# EasyEDA Pro project 摩托单驱(改）.eprj

# Schematic Schematic1
Create Date: 2023-11-26; Page Name: P1; Project Name: 有刷单驱第一版(2)更改; Schematic Name: Schematic1; Update Date: 2023-11-29; Company: 嘉立创EDA; Page Size: A4; Version: V1.0
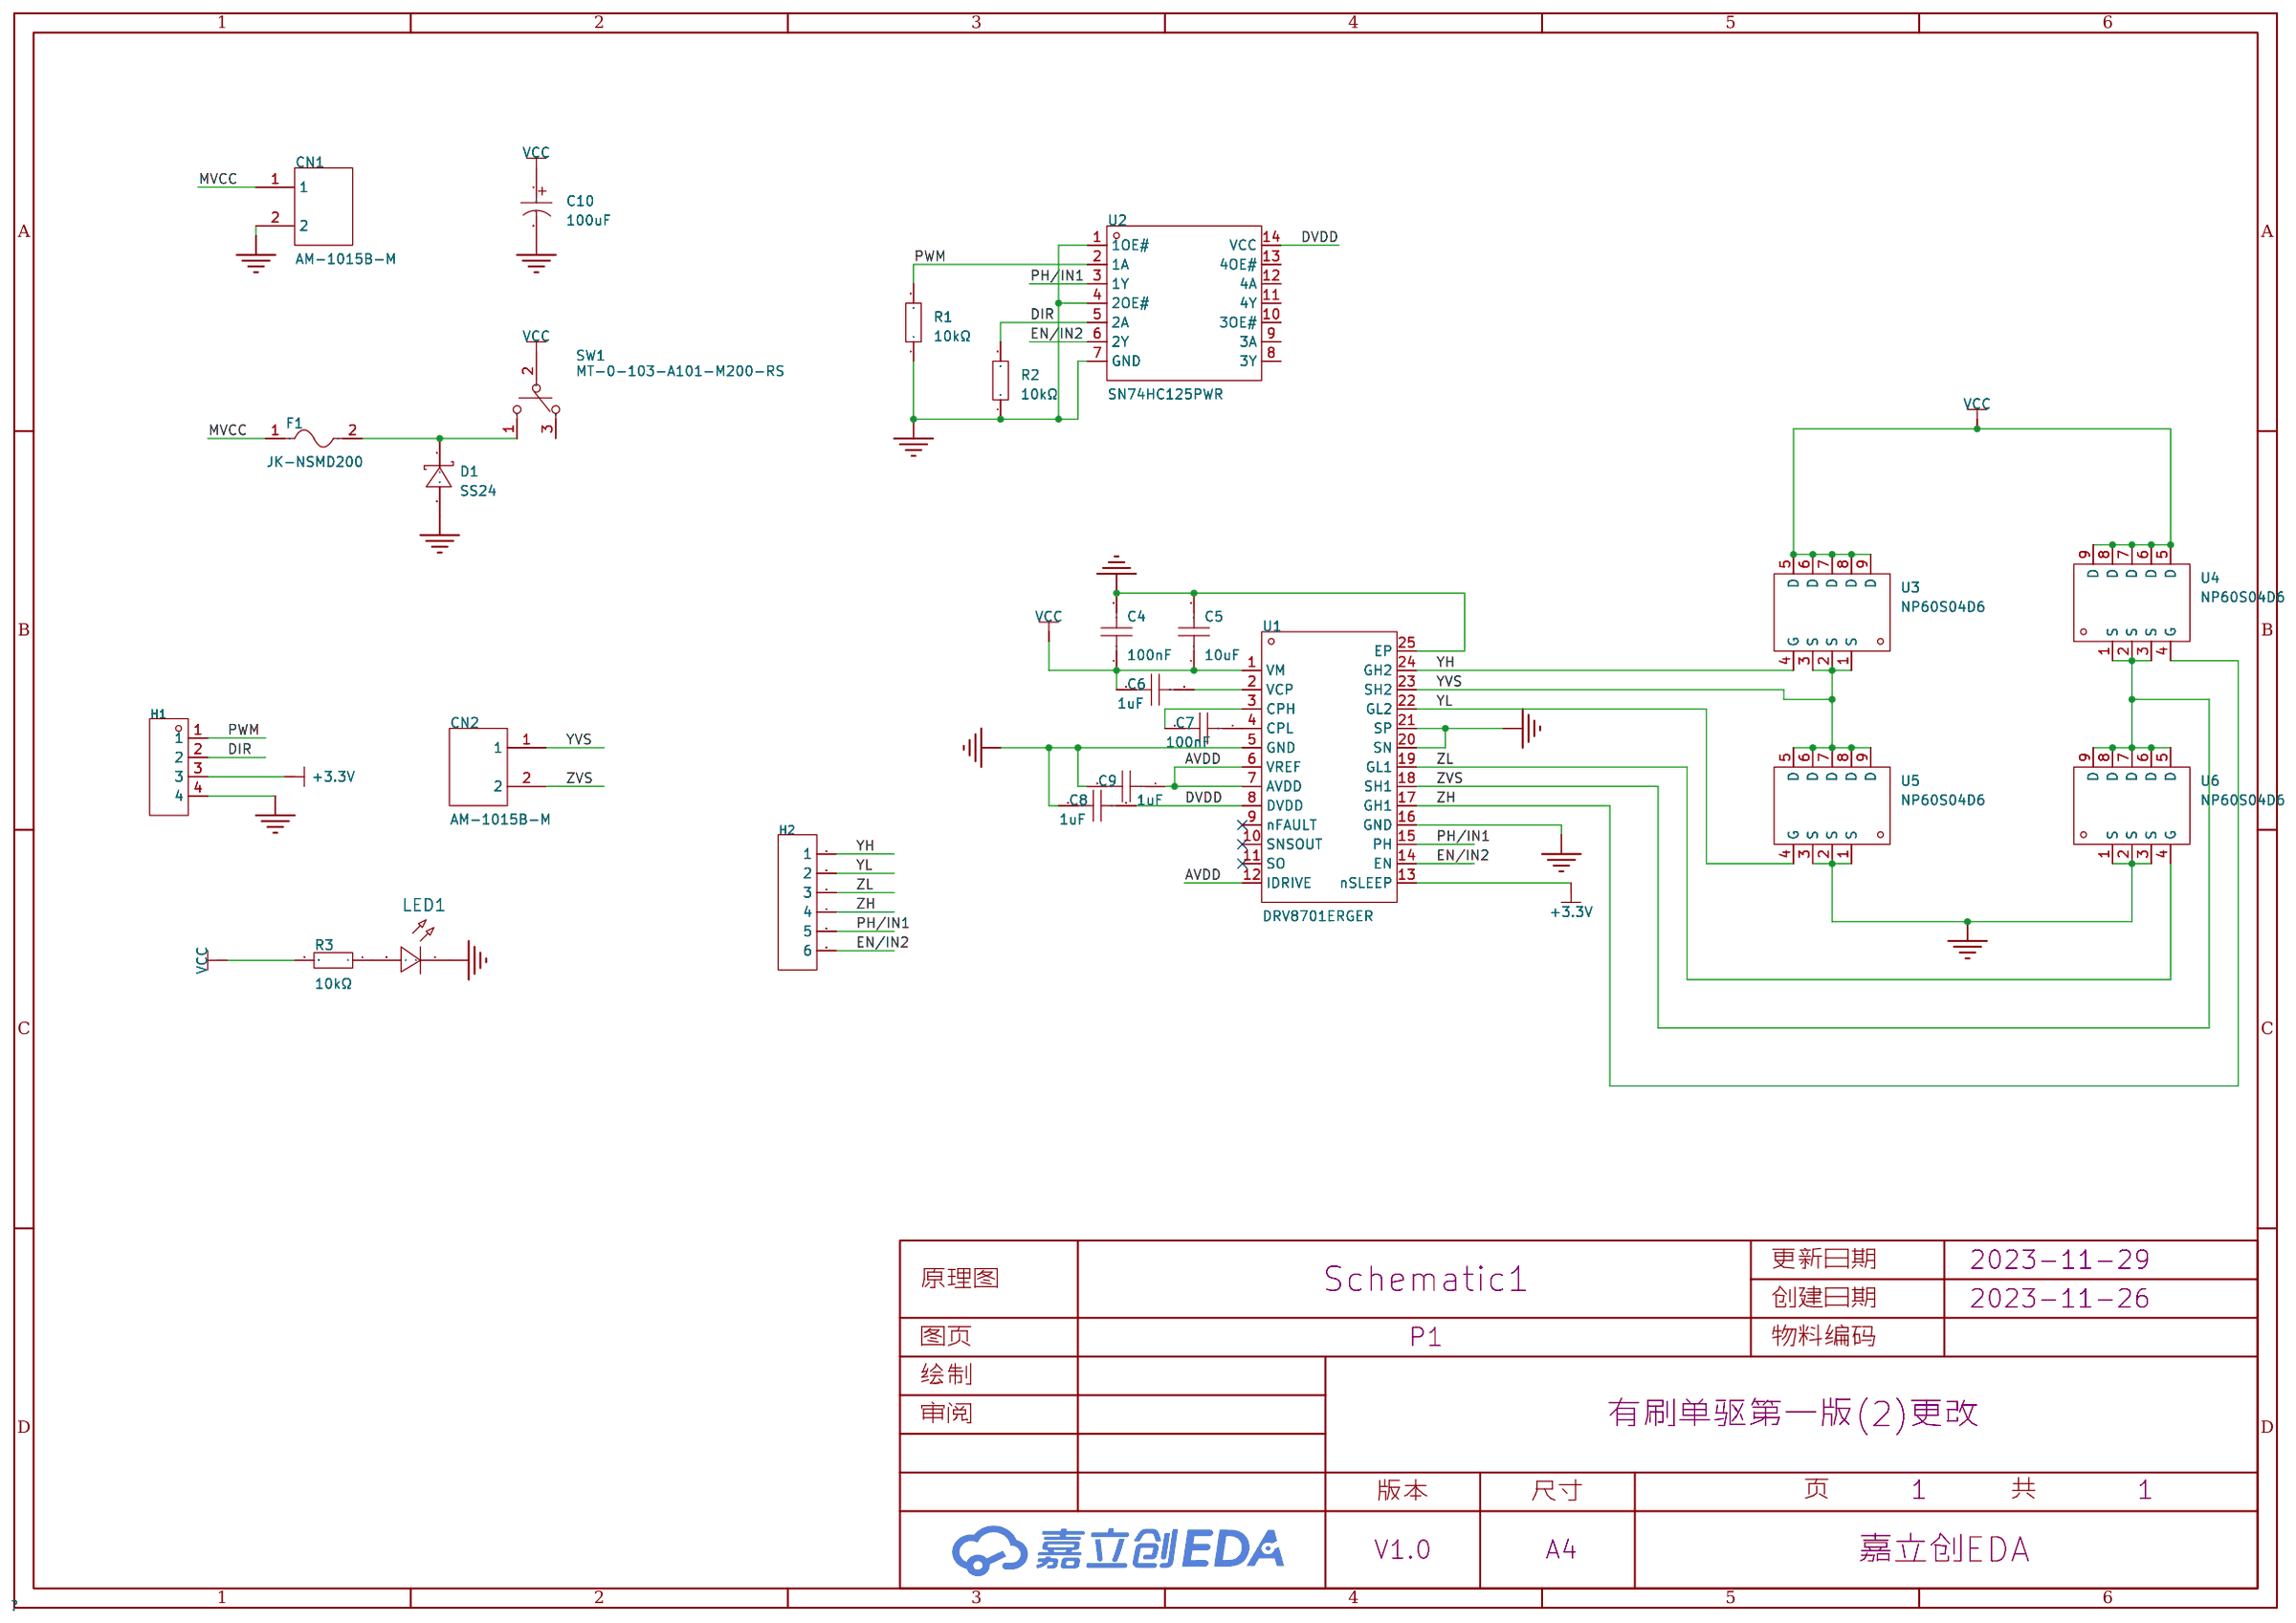
[diagram p0: schematic sheet]

## Parts
C4  100nF  [C0603]
C5  10uF  [C0603]
C6  1uF  [C0603]
C7  100nF  [C0603]
C8  1uF  [C0603]
C9  1uF  [C0603]
C10  100uF  [CAP-TH_BD6.3-P2.50-D1.0-FD]
CN1  AM-1015B-M  [CONN-TH_AM-1015B-M]
CN2  AM-1015B-M  [CONN-TH_AM-1015B-M]
D1  SS24  [SMA_L4.3-W2.6-LS5.2-RD]
F1  JK-NSMD200  [F1206]
H1  -  [HDR-TH_4P-P2.54-V-M]
H2  -  [HDR-TH_6P-P2.54-V-M-1]
LED1  -  [LED_0805]
R1  10kΩ  [R0603]
R2  10kΩ  [R0603]
R3  10kΩ  [R0603]
SW1  MT-0-103-A101-M200-RS  [SW-TH_MT-0-103-A101-M200-RS]
U1  DRV8701ERGER  [VQFN-24_L4.0-W4.0-P0.50-BL-EP2.5]
U2  SN74HC125PWR  [TSSOP-14_L5.0-W4.4-P0.65-LS6.5-BL]
U3  NP60S04D6  [PDFN-8_L5.8-W4.9-P1.27-LS6.1-BL]
U4  NP60S04D6  [PDFN-8_L5.8-W4.9-P1.27-LS6.1-BL]
U5  NP60S04D6  [PDFN-8_L5.8-W4.9-P1.27-LS6.1-BL]
U6  NP60S04D6  [PDFN-8_L5.8-W4.9-P1.27-LS6.1-BL]

## Library data of the parts
C4 C7 = CC0603KRX7R9BB104: 容值:100nF;精度:±10%;额定电压:50V;材质(温度系数):X7R;; LCSC Part Name: 100nF ±10% 50V; Supplier Part: C14663; Manufacturer: YAGEO(国巨); Supplier Footprint: 0603; JLCPCB Part Class: 基础库; Datasheet: https://atta.szlcsc.com/upload/public/pdf/source/20180910/C282072_33301C7F631E79921B82A8DAC6BCC5B3.pdf; Supplier: LCSC; Tolerance: ±10%; Voltage Rated: 50V; Temperature Coefficient: X7R
C5 = GRM188R6YA106MA73D: 容值:10uF;精度:±20%;额定电压:35V;材质(温度系数):-;; LCSC Part Name: 10uF ±20% 35V; Supplier Part: C194427; Manufacturer: muRata(村田); Supplier Footprint: 0603; JLCPCB Part Class: 扩展库; Datasheet: https://atta.szlcsc.com/upload/public/pdf/source/20210128/C194427_FCA3640823207DDB58700A82F1A19B5F.pdf; Supplier: LCSC; Tolerance: ±20%; Voltage Rated: 35V
C6 C8 C9 = GMK107BJ105KA-T: 容值:1uF;精度:±10%;额定电压:35V;温度系数:X5R;; LCSC Part Name: 1uF ±10% 35V; Supplier Part: C92796; Manufacturer: TAIYO YUDEN(太诱); Supplier Footprint: 0603; JLCPCB Part Class: 扩展库; Supplier: LCSC; Tolerance: ±10%; Voltage Rated: 35V; Temperature Coefficient: X5R
C10 = KM107M035E11RR0VH2FP0: 容值:100uF;精度:±20%;额定电压:35V;纹波电流:168mA@120Hz;等效串联电阻:-;; LCSC Part Name: 100uF ±20% 35V; Supplier Part: C19504; Manufacturer: CX(承兴); Supplier Footprint: 插件,D6.3xL11mm; JLCPCB Part Class: 扩展库; Datasheet: https://atta.szlcsc.com/upload/public/pdf/source/20211027/06D6BA3719C264B639DC286D935D03EA.pdf; Supplier: LCSC; Tolerance: ±20%; Rated Voltage: 35V; φD: 6.3mm; L: 11mm; Lead Spacing: 2.5mm; Ripple Current: 168mA@120Hz; Lifetime @ Temp: 1000hrs@105℃
CN1 CN2 = AM-1015B-M: 类别:-;类型1:-;; LCSC Part Name: AMASS(艾迈斯)电源连接器公头AM-1015B-M; Supplier Part: C90631; Manufacturer: AMASS(艾迈斯); JLCPCB Part Class: 扩展库; Datasheet: https://atta.szlcsc.com/upload/public/pdf/source/20161217/1481939174683.pdf; Supplier: LCSC; Brand: 艾迈斯; Type: T行插头; RatedVoltage: DC 500V; InterfaceType: 双公头; MetalMaterial: 铜镀金; InsulationMaterial: PA; RatedCurrent: 25A; RecommendedWireGauge: 12AWG; FlameRetardantGrade: UL94 V0; contact resistance: 0.45mΩ
D1 = SS24_C50645: 直流反向耐压(Vr):40V;平均整流电流(Io):2A;正向压降(Vf):550mV@2A;; LCSC Part Name: 40V 2A 550mV@2A SMA （相似料：C364270）; Supplier Part: C50645; Manufacturer: MDD; Supplier Footprint: SMA(DO-214AC); JLCPCB Part Class: 扩展库; Datasheet: https://atta.szlcsc.com/upload/public/pdf/source/20190304/C50645_5B6F2047F1B1EB9F2588B24BC6E81306.pdf; Supplier: LCSC; Reverse Voltage (Vr): 40V; Average Rectified Current (Io): 2A; Forward Voltage (Vf@If): 550mV@2A
F1 = JK-NSMD200: 最大电压:6V;最大电流:100A;保持电流:2A;跳闸电流:3.5A;; LCSC Part Name: 6V 2A 1206自恢复; Supplier Part: C561578; Manufacturer: JK(金科); Supplier Footprint: 1206; JLCPCB Part Class: 扩展库; Datasheet: https://atta.szlcsc.com/upload/public/pdf/source/20190807/C409806_27B0F7EFFA3D5CEE60CCD1EE0A933E0A.pdf; Supplier: LCSC; Operating Voltage (Max): 6V; Current Rating (Max): 100A; Hold Current: 2A; Trip Current: 3.5A; Resistance - Initial (Ri) (Min): 18mΩ; Resistance - Post Trip (R1) (Max): 80mΩ; Maximum Time to Trip: 1s; Operating Temperature: -40℃~+85℃
H1 = HDR-M_2.54_1x4P: Supplier Part: C492403; Supplier Footprint: 插件
H2 = HDR-M_2.54_1x6P: Supplier Part: C37208; Supplier Footprint: 插件
LED1 = LED_0805-R: Supplier Footprint: 0805
R1-R3 = 0603WAF1002T5E: 阻值:10kΩ;精度:±1%;功率:100mW;温度系数:±100ppm/℃;电阻类型:厚膜电阻;; LCSC Part Name: 10kΩ ±1% 100mW 厚膜电阻; Supplier Part: C25804; Manufacturer: UNI-ROYAL(厚声); Supplier Footprint: 0603; JLCPCB Part Class: 基础库; Datasheet: https://atta.szlcsc.com/upload/public/pdf/source/20200306/C422600_1E6D84923E4A46A82E41ADD87F860B5C.pdf; Supplier: LCSC; Tolerance: ±1%; Power(Watts): 100mW; Overload Voltage (Max): 75V; Temperature Coefficient: ±100ppm/℃; Type: 厚膜电阻; Operating Temperature Range: -55℃~+155℃
SW1 = MT-0-103-A101-M200-RS: 电路结构:单刀双掷;机械寿命:-;额定电流:5A;额定电压(AC):125V;安装方式:直插;; LCSC Part Name: 小型钮子三脚三档 五件套 含配件; Supplier Part: C1788493; Manufacturer: YUEN FUNG(源丰); Supplier Footprint: 插件; JLCPCB Part Class: Extended Part; Datasheet: https://atta.szlcsc.com/upload/public/pdf/source/20230720/A7297B66510B798CA716A50870BE0E5B.pdf; Supplier: LCSC; Circuit: 单刀双掷; Switch Length: 13mm; Switch Width: 8mm; Switch Height: 28.6mm; Contact Current: 5A; Voltage Rating (AC): 125V; Actuator Type: 圆柱钮柄; Pin Style: 焊片; Mounting Style: 直插; Operating Temperature: -25℃~+85℃
U1 = DRV8701ERGER: 类型:有刷直流电机;电源电压:5.9V~45V;输出电流:-;接口:并行;; LCSC Part Name: 有刷直流电机驱动芯片 45V; Supplier Part: C90964; Manufacturer: TI(德州仪器); Supplier Footprint: VQFN-24-EP(4x4); JLCPCB Part Class: 扩展库; Datasheet: https://atta.szlcsc.com/upload/public/pdf/source/20190902/C90964_2DCC43C1A4AE58E3ED96296E8C78517C.pdf; Supplier: LCSC; Type: 有刷直流电机; Supply Voltage: 5.9V~45V; Interface: 并行; Operating Temperature: -40℃~+125℃@(Ta)
U2 = SN74HC125PWR: 类型:缓冲器，非反相;电源电压:2V~6V;输入类型:-;输出类型:三态;低电平输出电流(IOL):7.8mA;高电平输出电流(IOH):7.8mA;工作温度:-40℃~+85℃;; Supplier Part: C132994; Manufacturer: TI(德州仪器); Supplier Footprint: TSSOP-14; JLCPCB Part Class: 扩展库; Datasheet: https://atta.szlcsc.com/upload/public/pdf/source/20170930/C132994_1506736365150997346.pdf; Supplier: LCSC; Type: 缓冲器，非反相; Supply Voltage: 2V~6V; output type: 三态; Current-OutputLow: 7.8mA; Current-OutputHigh: 7.8mA; Operating temperature: -40℃~+85℃
U3-U6 = NP60S04D6: 漏源电压(Vdss):40V;连续漏极电流(Id):60A;功率(Pd):35W;类型:N沟道;导通电阻(RDS(on)@Vgs,Id):5.9mΩ@10V,20A;; LCSC Part Name: N沟道 耐压:40V 电流:60A; Supplier Part: C2991150; Manufacturer: natlinear(南麟); Supplier Footprint: PDFN-8(5x6); JLCPCB Part Class: 扩展库; Datasheet: https://atta.szlcsc.com/upload/public/pdf/source/20220426/63C2F31CA04187D0D8A3123FE18E933A.pdf; Supplier: LCSC; Gate Threshold Voltage (Vgs(th)@Id): 1.7V@250uA; Drain Source Voltage (Vdss): 40V; Continuous Drain Current (Id): 60A; Power Dissipation (Pd): 35W; Type: N沟道; Drain Source On Resistance (RDS(on)@Vgs,Id): 5.9mΩ@10V,20A; Total Gate Charge (Qg@Vgs): 17nC@10V; Input Capacitance (Ciss@Vds): 740pF@20V; Reverse Transfer Capacitance (Crss@Vds): 36pF@20V; Operating Temperature: -55℃~+150℃@(Tj)

## Nets
+3.3V: H1.3 U1.13(nSLEEP)
AVDD: C9.1 U1.6(VREF) U1.7(AVDD) U1.12(IDRIVE)
DVDD: C8.1 U1.8(DVDD) U2.14(VCC)
GND: C4.2 C5.2 C8.2 C9.2 C10.2 CN1.2 D1.2(A) H1.4 LED1.1(C) R1.1 R2.1 U1.5(GND) U1.16(GND) U1.20(SN) U1.21(SP) U1.25(EP) U2.1(1OE#) U2.4(2OE#) U2.7(GND) U5.1(S) U5.2(S) U5.3(S) U6.1(S) U6.2(S) U6.3(S)
VCC: C4.1 C5.1 C6.1 C10.1 R3.2 SW1.2 U1.1(VM) U3.5(D) U3.6(D) U3.7(D) U3.8(D) U3.9(D) U4.5(D) U4.6(D) U4.7(D) U4.8(D) U4.9(D)
DIR: H1.2 R2.2 U2.5(2A)
EN/IN2: H2.6 U1.14(EN) U2.6(2Y)
MVCC: CN1.1 F1.1
PH/IN1: H2.5 U1.15(PH) U2.3(1Y)
PWM: H1.1 R1.2 U2.2(1A)
YH: H2.1 U1.24(GH2) U3.4(G)
YL: H2.2 U1.22(GL2) U5.4(G)
YVS: CN2.1 U1.23(SH2) U3.1(S) U3.2(S) U3.3(S) U5.5(D) U5.6(D) U5.7(D) U5.8(D) U5.9(D)
ZH: H2.4 U1.17(GH1) U4.4(G)
ZL: H2.3 U1.19(GL1) U6.4(G)
ZVS: CN2.2 U1.18(SH1) U4.1(S) U4.2(S) U4.3(S) U6.5(D) U6.6(D) U6.7(D) U6.8(D) U6.9(D)
$1N647: D1.1(K) F1.2 SW1.1
$1N2008: C6.2 U1.2(VCP)
$1N2043: C7.1 U1.4(CPL)
$1N2047: C7.2 U1.3(CPH)
$1N4499: LED1.2(A) R3.1

Not connected (* = marked no-connect by the designer): SW1 3; U1 9(nFAULT)* 10(SNSOUT)* 11(SO)*; U2 8(3Y) 9(3A) 10(3OE#) 11(4Y) 12(4A) 13(4OE#)

# Schematic Schematic2
Create Date: 2023-12-09; Page Name: P1; Project Name: 摩托单驱(改）; Schematic Name: Schematic2; Update Date: 2024-02-22; Company: 嘉立创EDA; Page Size: A4; Version: V1.0
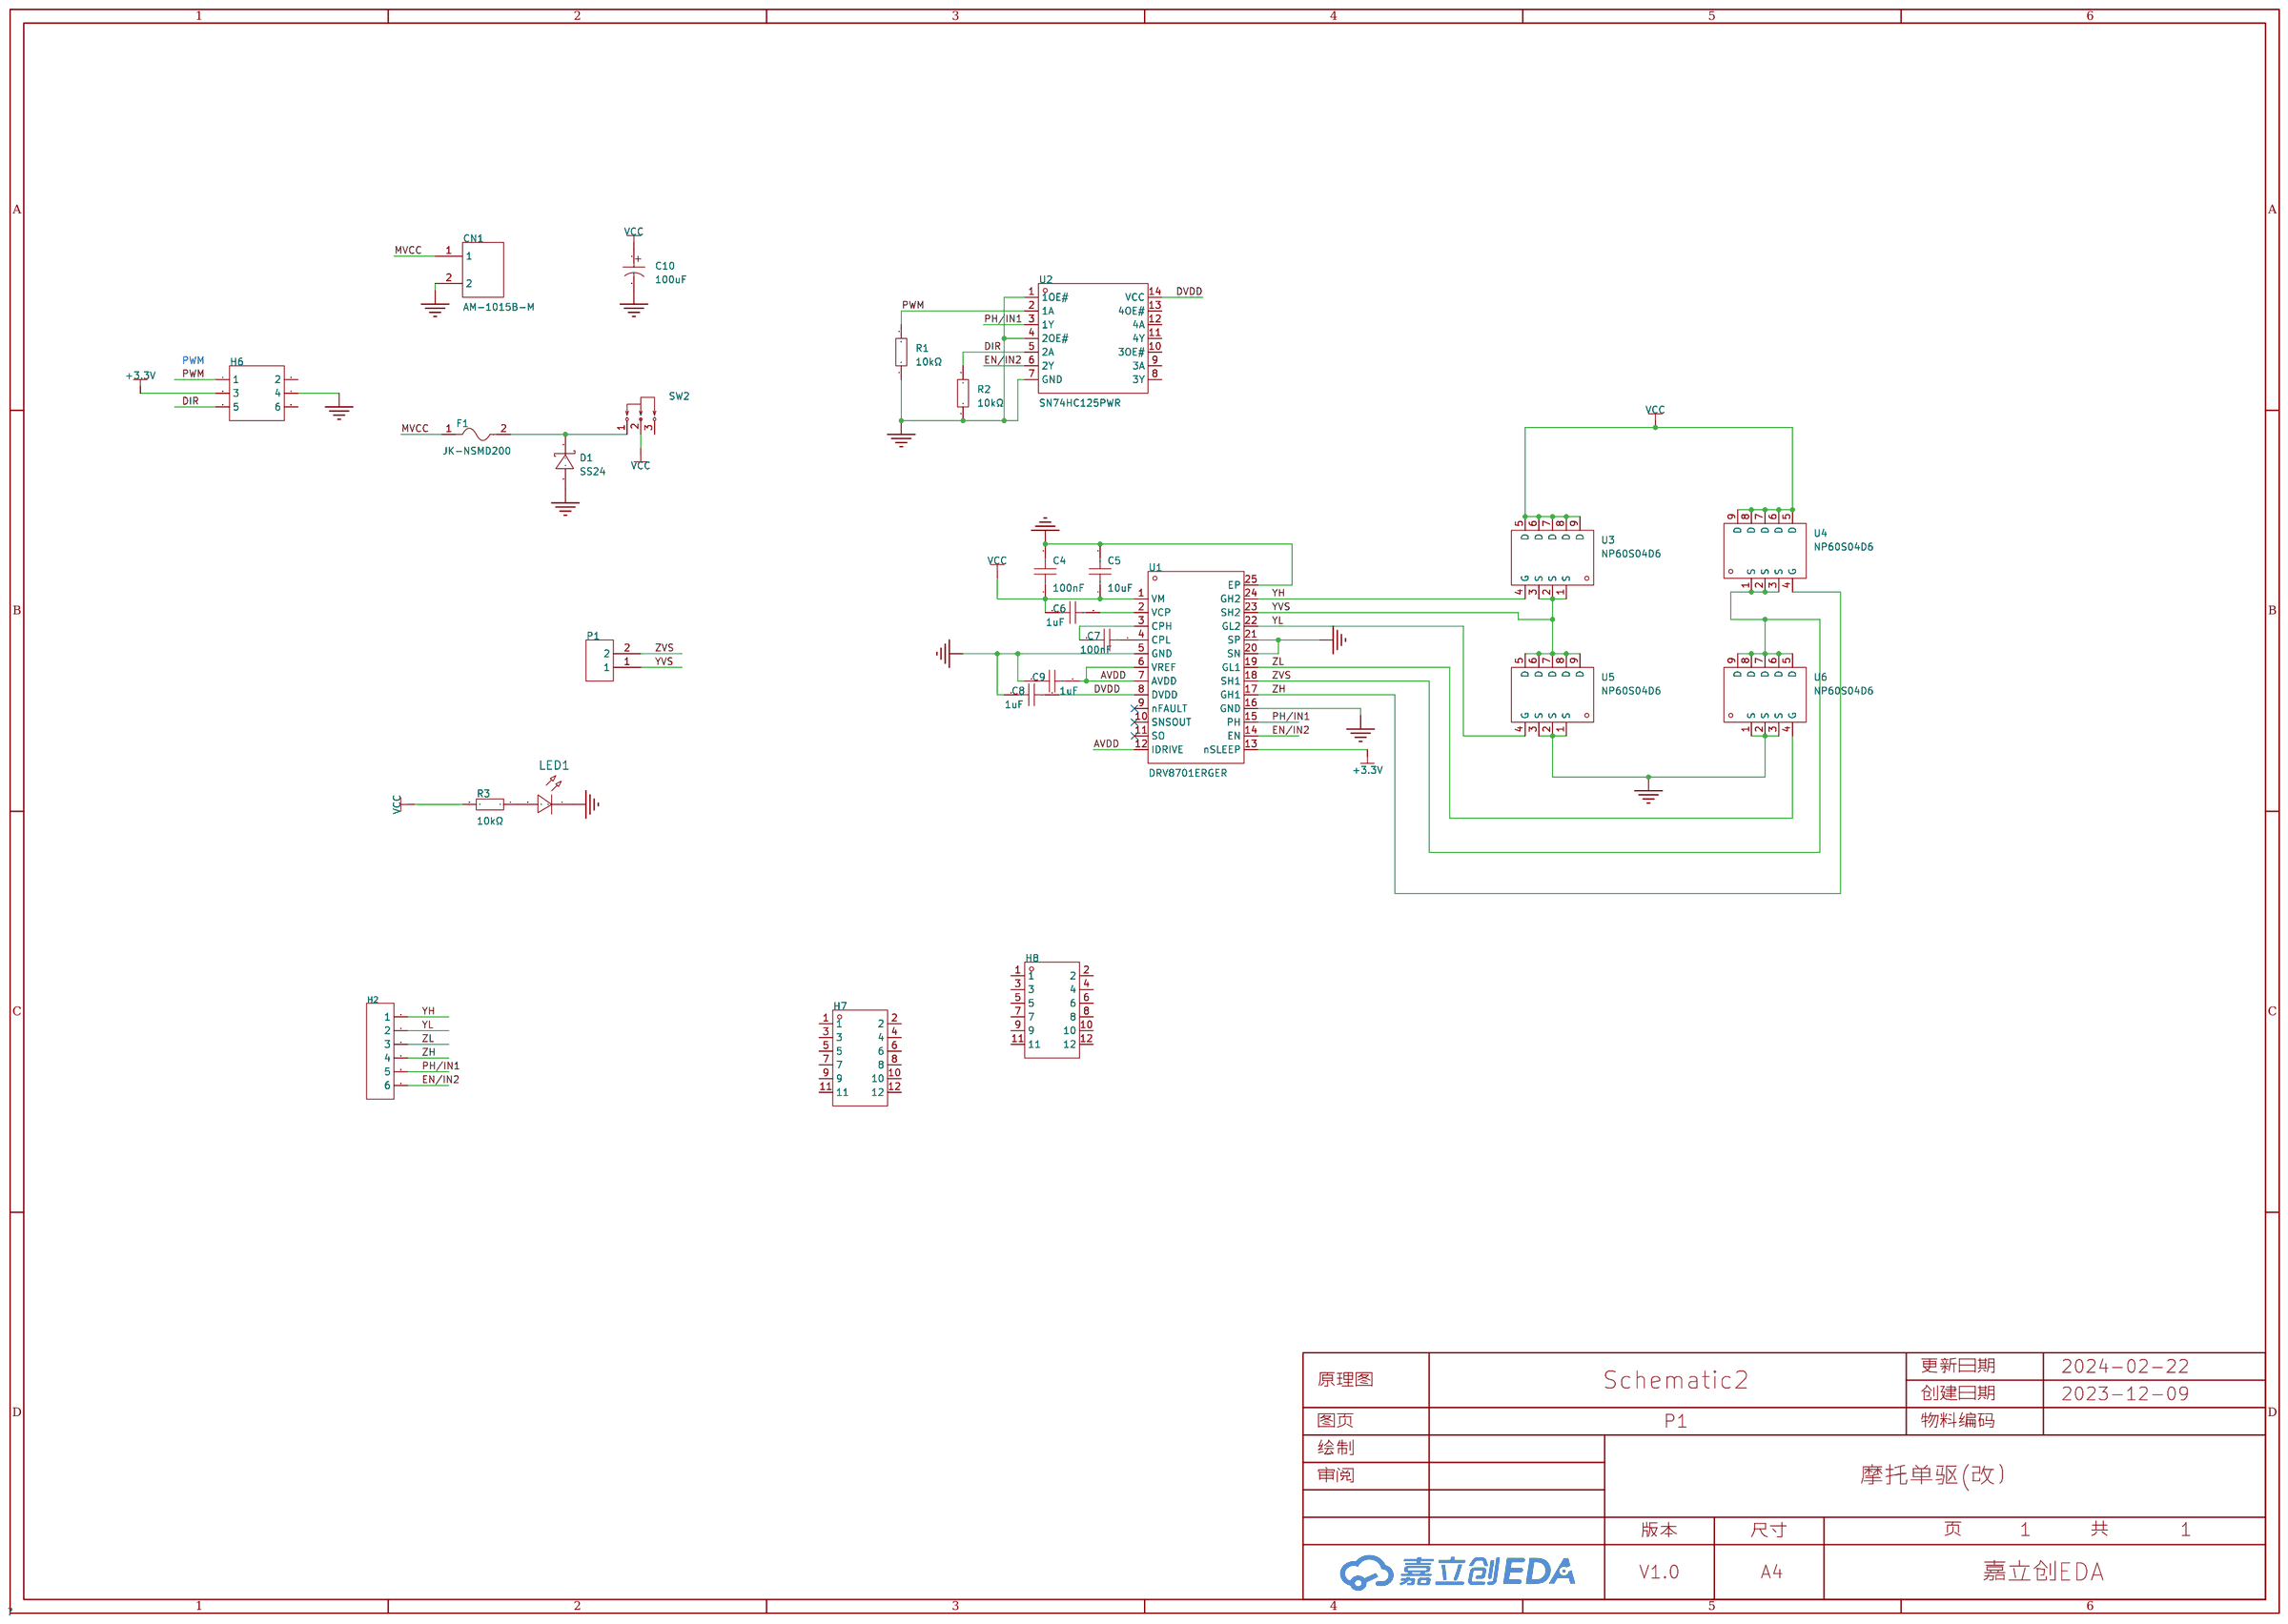
[diagram p1: schematic sheet]

## Parts
C4  100nF  [C0603]
C5  10uF  [C0603]
C6  1uF  [C0603]
C7  100nF  [C0603]
C8  1uF  [C0603]
C9  1uF  [C0603]
C10  100uF  [CAP-TH_BD6.3-P2.50-D1.0-FD]
CN1  AM-1015B-M  [CONN-TH_AM-1015B-M]
D1  SS24  [SMA_L4.3-W2.6-LS5.2-RD]
F1  JK-NSMD200  [F1206]
H2  -  [HDR-TH_6P-P2.54-V-M-1]
H6  -  [HDR-TH_6P-P2.54-V-R2-C3-S2.54_A2541WV-2X3P]
H7  -  [HDR-TH_12P-P2.54-V-M-R2-C6-S2.54]
H8  -  [HDR-TH_12P-P2.54-V-M-R2-C6-S2.54]
LED1  -  [LED_0805]
P1  WJ500V-5.08-2P  [CONN-TH_2P-P5.00_WJ500V-5.08-2P]
R1  10kΩ  [R0603]
R2  10kΩ  [R0603]
R3  10kΩ  [R0603]
SW2  SS12D10G4 071  [SW-TH_SHOU-HAN_SS12D10G4]
U1  DRV8701ERGER  [VQFN-24_L4.0-W4.0-P0.50-BL-EP2.5]
U2  SN74HC125PWR  [TSSOP-14_L5.0-W4.4-P0.65-LS6.5-BL]
U3  NP60S04D6  [PDFN-8_L5.8-W4.9-P1.27-LS6.1-BL]
U4  NP60S04D6  [PDFN-8_L5.8-W4.9-P1.27-LS6.1-BL]
U5  NP60S04D6  [PDFN-8_L5.8-W4.9-P1.27-LS6.1-BL]
U6  NP60S04D6  [PDFN-8_L5.8-W4.9-P1.27-LS6.1-BL]

## Library data of the parts
C4 C7 = CC0603KRX7R9BB104: 容值:100nF;精度:±10%;额定电压:50V;材质(温度系数):X7R;; LCSC Part Name: 100nF ±10% 50V; Supplier Part: C14663; Manufacturer: YAGEO(国巨); Supplier Footprint: 0603; JLCPCB Part Class: 基础库; Datasheet: https://atta.szlcsc.com/upload/public/pdf/source/20180910/C282072_33301C7F631E79921B82A8DAC6BCC5B3.pdf; Supplier: LCSC; Tolerance: ±10%; Voltage Rated: 50V; Temperature Coefficient: X7R
C5 = GRM188R6YA106MA73D: 容值:10uF;精度:±20%;额定电压:35V;材质(温度系数):-;; LCSC Part Name: 10uF ±20% 35V; Supplier Part: C194427; Manufacturer: muRata(村田); Supplier Footprint: 0603; JLCPCB Part Class: 扩展库; Datasheet: https://atta.szlcsc.com/upload/public/pdf/source/20210128/C194427_FCA3640823207DDB58700A82F1A19B5F.pdf; Supplier: LCSC; Tolerance: ±20%; Voltage Rated: 35V
C6 C8 C9 = GMK107BJ105KA-T: 容值:1uF;精度:±10%;额定电压:35V;温度系数:X5R;; LCSC Part Name: 1uF ±10% 35V; Supplier Part: C92796; Manufacturer: TAIYO YUDEN(太诱); Supplier Footprint: 0603; JLCPCB Part Class: 扩展库; Supplier: LCSC; Tolerance: ±10%; Voltage Rated: 35V; Temperature Coefficient: X5R
C10 = KM107M035E11RR0VH2FP0: 容值:100uF;精度:±20%;额定电压:35V;纹波电流:168mA@120Hz;等效串联电阻:-;; LCSC Part Name: 100uF ±20% 35V; Supplier Part: C19504; Manufacturer: CX(承兴); Supplier Footprint: 插件,D6.3xL11mm; JLCPCB Part Class: 扩展库; Datasheet: https://atta.szlcsc.com/upload/public/pdf/source/20211027/06D6BA3719C264B639DC286D935D03EA.pdf; Supplier: LCSC; Tolerance: ±20%; Rated Voltage: 35V; φD: 6.3mm; L: 11mm; Lead Spacing: 2.5mm; Ripple Current: 168mA@120Hz; Lifetime @ Temp: 1000hrs@105℃
CN1 = AM-1015B-M: 类别:-;类型1:-;; LCSC Part Name: AMASS(艾迈斯)电源连接器公头AM-1015B-M; Supplier Part: C90631; Manufacturer: AMASS(艾迈斯); JLCPCB Part Class: 扩展库; Datasheet: https://atta.szlcsc.com/upload/public/pdf/source/20161217/1481939174683.pdf; Supplier: LCSC; Brand: 艾迈斯; Type: T行插头; RatedVoltage: DC 500V; InterfaceType: 双公头; MetalMaterial: 铜镀金; InsulationMaterial: PA; RatedCurrent: 25A; RecommendedWireGauge: 12AWG; FlameRetardantGrade: UL94 V0; contact resistance: 0.45mΩ
D1 = SS24_C50645: 直流反向耐压(Vr):40V;平均整流电流(Io):2A;正向压降(Vf):550mV@2A;; LCSC Part Name: 40V 2A 550mV@2A SMA （相似料：C364270）; Supplier Part: C50645; Manufacturer: MDD; Supplier Footprint: SMA(DO-214AC); JLCPCB Part Class: 扩展库; Datasheet: https://atta.szlcsc.com/upload/public/pdf/source/20190304/C50645_5B6F2047F1B1EB9F2588B24BC6E81306.pdf; Supplier: LCSC; Reverse Voltage (Vr): 40V; Average Rectified Current (Io): 2A; Forward Voltage (Vf@If): 550mV@2A
F1 = JK-NSMD200: 最大电压:6V;最大电流:100A;保持电流:2A;跳闸电流:3.5A;; LCSC Part Name: 6V 2A 1206自恢复; Supplier Part: C561578; Manufacturer: JK(金科); Supplier Footprint: 1206; JLCPCB Part Class: 扩展库; Datasheet: https://atta.szlcsc.com/upload/public/pdf/source/20190807/C409806_27B0F7EFFA3D5CEE60CCD1EE0A933E0A.pdf; Supplier: LCSC; Operating Voltage (Max): 6V; Current Rating (Max): 100A; Hold Current: 2A; Trip Current: 3.5A; Resistance - Initial (Ri) (Min): 18mΩ; Resistance - Post Trip (R1) (Max): 80mΩ; Maximum Time to Trip: 1s; Operating Temperature: -40℃~+85℃
H2 = HDR-M_2.54_1x6P: Supplier Part: C37208; Supplier Footprint: 插件
H6 = HDR-M_2.54_2x3: Supplier Part: C402781; Supplier Footprint: 插件,P=2.54mm
H7 H8 = HDR-M_2.54_2x6: Supplier Part: C30734; Supplier Footprint: 插件,P=2.54mm
LED1 = LED_0805-R: Supplier Footprint: 0805
P1 = WJ500V-5.08-2P: 结构:1x2P;间距:5.08mm;颜色:绿色;安装方式:直插;额定电流:18A;额定电压:250V;排数:1;线规 - AWG:14~30;线规 - 平方毫米:2.5;每排PIN数:2;工作温度范围:-40℃~+105℃;; LCSC Part Name: 5.08mm 1x2P 排数:1 每排P数:2 直插; Supplier Part: C8465; Manufacturer: KANGNEX(康奈克斯电气); Supplier Footprint: 插件,P=5.08mm; JLCPCB Part Class: 扩展库; Datasheet: https://atta.szlcsc.com/upload/public/pdf/source/20191225/C8465_02D34CE5B5B4A53DF5891601D97FA9F4.pdf; Supplier: LCSC; Structure: 1x2P; Pitch: 5.08mm; Color: 绿色; Mounting Style: 直插; Current Rating (Max): 18A; Voltage Rating (Max): 250V; Number of Pins: 2P; Number of Rows: 1; Wire Gauge - AWG: 14~30; Wire Gauge - mm2: 2.5; Number of PINs Per Row: 2; Operating Temperature Range: -40℃~+105℃
R1-R3 = 0603WAF1002T5E: 阻值:10kΩ;精度:±1%;功率:100mW;温度系数:±100ppm/℃;电阻类型:厚膜电阻;; LCSC Part Name: 10kΩ ±1% 100mW 厚膜电阻; Supplier Part: C25804; Manufacturer: UNI-ROYAL(厚声); Supplier Footprint: 0603; JLCPCB Part Class: 基础库; Datasheet: https://atta.szlcsc.com/upload/public/pdf/source/20200306/C422600_1E6D84923E4A46A82E41ADD87F860B5C.pdf; Supplier: LCSC; Tolerance: ±1%; Power(Watts): 100mW; Overload Voltage (Max): 75V; Temperature Coefficient: ±100ppm/℃; Type: 厚膜电阻; Operating Temperature Range: -55℃~+155℃
SW2 = SS12D10G4 071: 电路结构:单刀双掷;安装方式:直插;开关颜色:-;额定电流(DC):2A;额定电压(DC):125V;额定电流(AC):-;额定电压(AC):-;机械寿命:3千次;; Supplier Part: C2887259; Manufacturer: SHOU HAN(首韩); Supplier Footprint: 插件; JLCPCB Part Class: 扩展库; Datasheet: https://atta.szlcsc.com/upload/public/pdf/source/20210820/80D1704BBF3FCEE0435FCAA54C61E0A3.pdf; Supplier: LCSC; Circuit: 单刀双掷; Pin Style: PC引脚; Switch Length: 12.7mm; Switch Width: 6.7mm; Switch Height: 6.4mm; Mounting Style: 直插; Current Rating (DC): 2A; Voltage Rating (DC): 125V; Mechanical Life: 3千次; Operating Temperature: -16℃~+60℃
U1 = DRV8701ERGER: 类型:有刷直流电机;电源电压:5.9V~45V;输出电流:-;接口:并行;; LCSC Part Name: 有刷直流电机驱动芯片 45V; Supplier Part: C90964; Manufacturer: TI(德州仪器); Supplier Footprint: VQFN-24-EP(4x4); JLCPCB Part Class: 扩展库; Datasheet: https://atta.szlcsc.com/upload/public/pdf/source/20190902/C90964_2DCC43C1A4AE58E3ED96296E8C78517C.pdf; Supplier: LCSC; Type: 有刷直流电机; Supply Voltage: 5.9V~45V; Interface: 并行; Operating Temperature: -40℃~+125℃@(Ta)
U2 = SN74HC125PWR: 类型:缓冲器，非反相;电源电压:2V~6V;输入类型:-;输出类型:三态;低电平输出电流(IOL):7.8mA;高电平输出电流(IOH):7.8mA;工作温度:-40℃~+85℃;; Supplier Part: C132994; Manufacturer: TI(德州仪器); Supplier Footprint: TSSOP-14; JLCPCB Part Class: 扩展库; Datasheet: https://atta.szlcsc.com/upload/public/pdf/source/20170930/C132994_1506736365150997346.pdf; Supplier: LCSC; Type: 缓冲器，非反相; Supply Voltage: 2V~6V; output type: 三态; Current-OutputLow: 7.8mA; Current-OutputHigh: 7.8mA; Operating temperature: -40℃~+85℃
U3-U6 = NP60S04D6: 漏源电压(Vdss):40V;连续漏极电流(Id):60A;功率(Pd):35W;类型:N沟道;导通电阻(RDS(on)@Vgs,Id):5.9mΩ@10V,20A;; LCSC Part Name: N沟道 耐压:40V 电流:60A; Supplier Part: C2991150; Manufacturer: natlinear(南麟); Supplier Footprint: PDFN-8(5x6); JLCPCB Part Class: 扩展库; Datasheet: https://atta.szlcsc.com/upload/public/pdf/source/20220426/63C2F31CA04187D0D8A3123FE18E933A.pdf; Supplier: LCSC; Gate Threshold Voltage (Vgs(th)@Id): 1.7V@250uA; Drain Source Voltage (Vdss): 40V; Continuous Drain Current (Id): 60A; Power Dissipation (Pd): 35W; Type: N沟道; Drain Source On Resistance (RDS(on)@Vgs,Id): 5.9mΩ@10V,20A; Total Gate Charge (Qg@Vgs): 17nC@10V; Input Capacitance (Ciss@Vds): 740pF@20V; Reverse Transfer Capacitance (Crss@Vds): 36pF@20V; Operating Temperature: -55℃~+150℃@(Tj)

## Nets
+3.3V: H6.3 U1.13(nSLEEP)
AVDD: C9.1 U1.6(VREF) U1.7(AVDD) U1.12(IDRIVE)
DVDD: C8.1 U1.8(DVDD) U2.14(VCC)
GND: C4.2 C5.2 C8.2 C9.2 C10.2 CN1.2 D1.2(A) H6.4 LED1.1(C) R1.1 R2.1 U1.5(GND) U1.16(GND) U1.20(SN) U1.21(SP) U1.25(EP) U2.1(1OE#) U2.4(2OE#) U2.7(GND) U5.1(S) U5.2(S) U5.3(S) U6.1(S) U6.2(S) U6.3(S)
VCC: C4.1 C5.1 C6.1 C10.1 R3.2 SW2.2 U1.1(VM) U3.5(D) U3.6(D) U3.7(D) U3.8(D) U3.9(D) U4.5(D) U4.6(D) U4.7(D) U4.8(D) U4.9(D)
DIR: H6.5 R2.2 U2.5(2A)
EN/IN2: H2.6 U1.14(EN) U2.6(2Y)
MVCC: CN1.1 F1.1
PH/IN1: H2.5 U1.15(PH) U2.3(1Y)
PWM: H6.1 R1.2 U2.2(1A)
YH: H2.1 U1.24(GH2) U3.4(G)
YL: H2.2 U1.22(GL2) U5.4(G)
YVS: P1.1 U1.23(SH2) U3.1(S) U3.2(S) U3.3(S) U5.5(D) U5.6(D) U5.7(D) U5.8(D) U5.9(D)
ZH: H2.4 U1.17(GH1) U4.4(G)
ZL: H2.3 U1.19(GL1) U6.4(G)
ZVS: P1.2 U1.18(SH1) U4.1(S) U4.2(S) U4.3(S) U6.5(D) U6.6(D) U6.7(D) U6.8(D) U6.9(D)
$1N1344: D1.1(K) F1.2 SW2.1
$1N1370: C6.2 U1.2(VCP)
$1N1371: C7.1 U1.4(CPL)
$1N1372: C7.2 U1.3(CPH)
$1N1403: LED1.2(A) R3.1

Not connected (* = marked no-connect by the designer): H6 2 6; H7 1 2 3 4 5 6 7 8 9 10 11 12; H8 1 2 3 4 5 6 7 8 9 10 11 12; SW2 3; U1 9(nFAULT)* 10(SNSOUT)* 11(SO)*; U2 8(3Y) 9(3A) 10(3OE#) 11(4Y) 12(4A) 13(4OE#)

## Notes on the sheet
- PWM

# Board PCB1
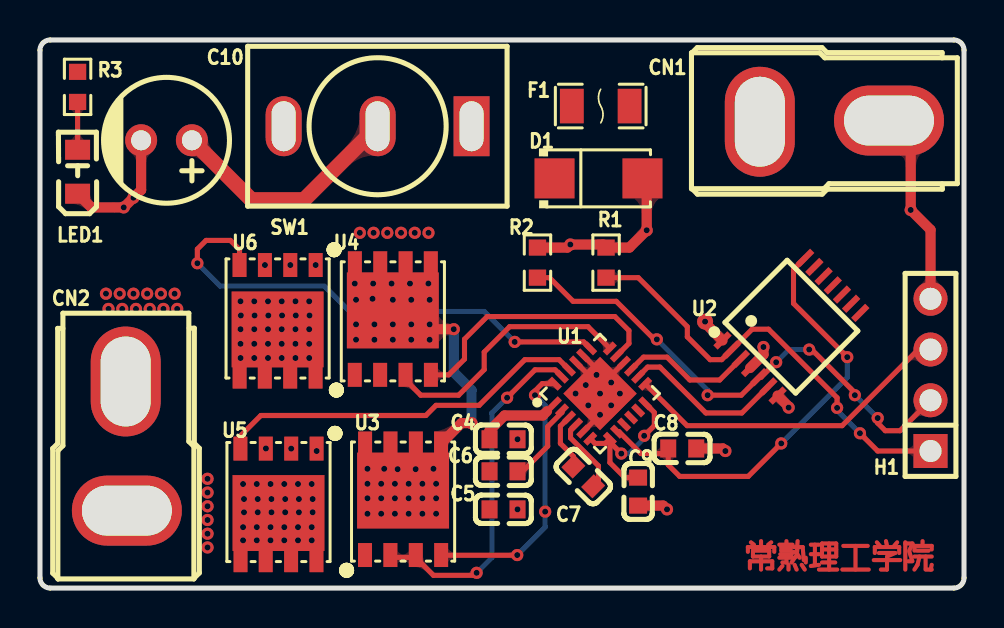
[diagram p2: board, top side]
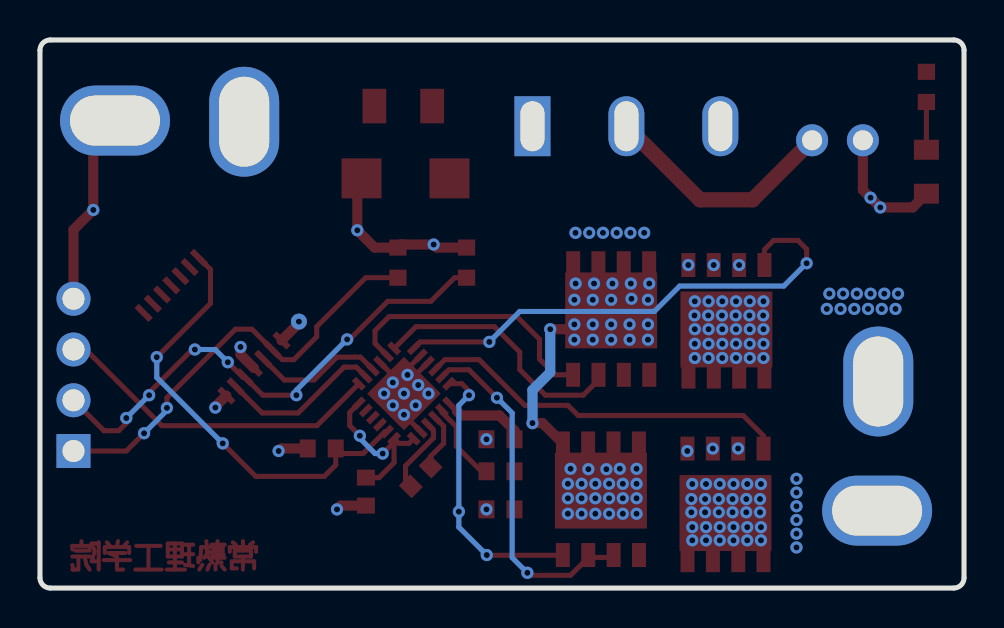
[diagram p3: board, bottom side, seen from below]

Outline 46.23 x 27.43 mm; copper layers: Top Layer, Bottom Layer. Coordinates in mm from the lower left corner of the outline.
Outline path: 0,26.92 0,0.51 arc(0.15,0.15) 0.51,0 45.72,0 arc(46.08,0.15) 46.23,0.51 46.23,26.92 arc(46.08,27.28) 45.72,27.43 0.51,27.43 arc(0.15,27.28) 0,26.92
Stack: Top Layer 0.035mm / Dielectric1 1.51mm FR4 er 4.5 / Bottom Layer 0.035mm

## Design rules (mm)
template: 自定义配置
spacing copperThickness1oz (default): track to track 0.102, other pairs 0.152 to 0.3
spacing copperThickness2oz: track to track 0.203, other pairs 0.152 to 0.3
track width copperThickness1oz (default): min 0.127, default 0.254, max 2.54
track width copperThickness2oz: min 0.203, default 0.254, max 2.54
differential pair differentialPair (default): width min 0.127, default 0.254, max 2.54; gap min 0.152, default 0.152
via viaSize (default): diameter min 0.5, default 0.61, max 10; hole min 0.3, default 0.305, max 6.299
pour e107 uses copperRegion

## Placement (name value [footprint] x y rotation side)
C4  100nF  [C0603]  23.19 7.45 0 top
C5  10uF  [C0603]  23.19 3.94 0 top
C6  1uF  [C0603]  23.19 5.84 0 top
C7  100nF  [C0603]  27.18 5.59 135 top
C8  1uF  [C0603]  32.13 6.98 0 top
C9  1uF  [C0603]  29.92 4.83 270 top
C10  100uF  [CAP-TH_BD6.3-P2.50-D1.0-FD]  6.33 22.41 180 top
CN1  AM-1015B-M  [CONN-TH_AM-1015B-M]  39.24 23.37 0 top
CN2  AM-1015B-M  [CONN-TH_AM-1015B-M]  4.32 7.11 90 top
D1  SS24  [SMA_L4.3-W2.6-LS5.2-RD]  27.94 20.5 0 top
F1  JK-NSMD200  [F1206]  28.05 24.12 180 top
H1  -  [HDR-TH_4P-P2.54-V-M]  44.55 10.67 90 top
LED1  -  [LED_0805]  1.89 20.89 90 top
R1  10kΩ  [R0603]  28.32 16.29 270 top
R2  10kΩ  [R0603]  24.89 16.29 270 top
R3  10kΩ  [R0603]  1.88 25.08 90 top
SW1  MT-0-103-A101-M200-RS  [SW-TH_MT-0-103-A101-M200-RS]  16.89 23.11 180 top
U1  DRV8701ERGER  [VQFN-24_L4.0-W4.0-P0.50-BL-EP2.5]  28.02 9.73 315 top
U2  SN74HC125PWR  [TSSOP-14_L5.0-W4.4-P0.65-LS6.5-BL]  37.59 13.08 315 top
U3  NP60S04D6  [pdfn-8_l5.8-w4.9-p1.27-ls6.1-bl]  18.17 4.44 0 top
U4  NP60S04D6  [PDFN-8_L5.8-W4.9-P1.27-LS6.1-BL]  17.65 13.46 0 top
U5  NP60S04D6  [PDFN-8_L5.8-W4.9-P1.27-LS6.1-BL]  11.93 4.19 180 top
U6  NP60S04D6  [PDFN-8_L5.8-W4.9-P1.27-LS6.1-BL]  11.89 13.38 180 top

## Footprints (pads in the part's own frame, mm; a bottom-side part is the same pattern mirrored in y, then rotated)
C0603
  rect 0.8x0.9 smd: 1(-0.7,0) 2(0.7,0)
CAP-TH_BD6.3-P2.50-D1.0-FD
  round 1.6 hole 1: 1(-1.27,0) 2(1.27,0)
CONN-TH_AM-1015B-M
  oval 3.5x5.5 hole 2.5x4.5: 1(-3.231,-0.029)
  oval 5.5x3.5 hole 4.5x2.5: 2(3.231,0.029)
F1206
  rect 1.19x1.728 smd: 1(-1.445,0) 2(1.445,0)
HDR-TH_4P-P2.54-V-M
  rect 1.7x1.7 hole 1.1: 1(-3.81,0)
  round 1.7 hole 1.1: 2(-1.27,0) 3(1.27,0) 4(3.81,0)
LED_0805
  rect 1x1.25 smd: 1(-1.15,0.005) 2(1.05,0.005)
PDFN-8_L5.8-W4.9-P1.27-LS6.1-BL
  rect 0.7x1.2 smd: 1(-1.905,-2.792) 2(-0.635,-2.792) 3(0.635,-2.792) 4(1.905,-2.792) 5(1.9,2.792) 6(0.64,2.792) 7(-0.63,2.792) 8(-1.9,2.792)
  rect 4.6x3.8 smd: 9(0,0.432)
pdfn-8_l5.8-w4.9-p1.27-ls6.1-bl
  rect 0.7x1.2 smd: 1(-1.905,-2.792) 2(-0.635,-2.792) 3(0.635,-2.792) 4(1.905,-2.792) 5(1.9,2.792) 6(0.64,2.792) 7(-0.63,2.792) 8(-1.9,2.792)
  rect 4.6x3.8 smd: 9(0,0.432)
R0603
  rect 0.806x0.864 smd: 1(-0.753,0) 2(0.753,0)
SMA_L4.3-W2.6-LS5.2-RD
  rect 2x2 smd: 1(-2.2,0) 2(2.2,0)
SW-TH_MT-0-103-A101-M200-RS
  rect 1.8x3 hole 1.2x2.5: 1(-4.7,0)
  oval 1.8x3 hole 1.2x2.5: 2(0,0) 3(4.7,0)
TSSOP-14_L5.0-W4.4-P0.65-LS6.5-BL
  rect 0.305x0.991 smd: 1(-1.95,-2.925) 2(-1.3,-2.925) 3(-0.65,-2.925) 4(0,-2.925) 5(0.65,-2.925) 6(1.3,-2.925) 7(1.95,-2.925) 8(1.95,2.925) 9(1.3,2.925) 10(0.65,2.925) 11(0,2.925) 12(-0.65,2.925) 13(-1.3,2.925) 14(-1.95,2.925)
VQFN-24_L4.0-W4.0-P0.50-BL-EP2.5
  rect 0.3x0.7 smd: 1(-1.25,-1.942) 2(-0.75,-1.942) 3(-0.25,-1.942) 4(0.25,-1.942) 5(0.75,-1.942) 6(1.25,-1.942) 13(1.25,1.942) 14(0.75,1.942) 15(0.25,1.942) 16(-0.25,1.942) 17(-0.75,1.942) 18(-1.25,1.942)
  rect 0.7x0.3 smd: 7(1.948,-1.25) 8(1.948,-0.75) 9(1.948,-0.25) 10(1.948,0.25) 11(1.948,0.75) 12(1.948,1.25) 19(-1.948,1.25) 20(-1.948,0.75) 21(-1.948,0.25) 22(-1.948,-0.25) 23(-1.948,-0.75) 24(-1.948,-1.25)
  rect 2.6x2.6 smd: 25(0.001,-0.001)

## Nets
As in the schematic.

Pads without a net: SW1 3; U1 9 10 11; U2 8 9 10 11 12 13

## Via types
v1: diameter 0.61, hole 0.305, Top Layer to Bottom Layer, 174 vias
v2: diameter 0.8, hole 0.305, Top Layer to Bottom Layer, 1 via

## Routing (per net, layer and track width the routed paths; a pad name or vN(x,y) marks a point on that pad's centre or on a via; arc(x,y) is an arc through that point)
+3.3V: length 16.7
  Top Layer w0.254: U1.13 32.37,8.13 40.13,8.13 43.94,11.94 H1.3
AVDD: length 8.5
  Top Layer w0.254: 28.51,7.3 28.51,6.28 29.26,5.53 C9.1 ; 28.51,7.3 v1(29.08,6.73) ; 28.51,7.3 U1.7 28.28,7.24 27.77,7.24 U1.6 ; U1.12 30.73,8.79 30.73,8.13 v1(30.23,7.62)
  Bottom Layer w0.254: v1(30.23,7.62) 30.23,7.49 29.46,6.73 v1(29.08,6.73)
DVDD: length 22.5
  Top Layer w0.254: v1(37.08,7.24) 35.43,5.59 32,5.59 31.43,6.16 C8.1 31.18,6.73 30.06,6.73 28.97,7.83 28.87,7.83 ; v1(40.39,11.56) 37.7,14.25 37.7,15.94 U2.14
  Bottom Layer w0.254: v1(37.08,7.24) 40.39,10.54 v1(40.39,11.56)
GND: length 39.1
  Top Layer w0.254: U1.5 v1(28.02,8.67) v1(28.02,9.73) 28.02,10.09 ; U1.20 28.02,10.8 28.02,10.09 ; 28.02,10.09 29.21,11.28 ; 28.02,10.09 U1.21
  Top Layer w0.508: v1(31.37,3.94) 31.18,4.13 C9.2 ; C10.2 5.06,19.92 v1(4.68,19.54) v1(4.19,19.05) 2.57,19.05 LED1.1 ; R2.1 26.38,17.04 v1(26.53,17.19) 28.17,17.19 R1.1 29.49,17.04 v1(30.35,17.91) 30.35,20.29 D1.2 ; C8.2 34.16,6.98 v1(34.29,6.86) ; U2.7 37.45,9.08 v1(37.45,9.03) ; U2.4 36.2,11.68 v1(36.2,12.06) ; 34.14,12.39 33.27,13.26 v2(33.27,13.33) ; H1.4 44.55,17.93 v1(43.56,18.92) 43.56,22.31 42.47,23.4
  vias: v1(11.25,16.17) v1(11.3,6.98) v1(12.52,16.17) v1(12.57,6.98) v1(13.79,16.17) v1(13.84,6.86) v1(23.89,7.45) v1(23.89,3.94) v1(26.79,9.73) v1(27.3,10.16) v1(27.43,9.14) v1(27.84,10.67) v1(28.58,10.29) v1(28.58,9.14) v1(29.01,9.73)
VCC: length 26.2
  Top Layer w0.508: C4.1 22.49,7.89 23.24,8.64 25.15,8.64 25.37,8.85 ; U4.9 18.6,12.95 v1(20.7,12.95) ; 20.05,7.22 21.08,8.25 v1(21.59,8.25)
  Top Layer w0.762: SW1.2 13.21,19.43 10.58,19.43 C10.1
  Bottom Layer w0.508: v1(20.7,12.95) 20.7,10.8 21.59,9.91 v1(21.59,8.25)
  vias: v1(15.75,15.24) v1(15.81,14.43) v1(15.81,13.2) v1(15.81,12.43) v1(16,17.78) v1(16.38,5.97) v1(16.38,5.22) v1(16.38,4.49) v1(16.38,3.72) v1(16.69,17.78) v1(16.67,15.24) v1(16.64,14.48) v1(16.73,13.2) v1(16.73,12.43) v1(17.07,5.22) v1(17.07,4.49) v1(17.07,3.72) v1(17.22,5.97) v1(17.38,17.78) v1(17.59,15.24) v1(17.65,14.43) v1(17.65,13.2) v1(17.65,12.43) v1(17.76,5.22) v1(17.76,4.49) v1(17.76,3.72) v1(17.89,5.95) v1(18.06,17.78) v1(18.44,5.22) v1(18.44,4.49) v1(18.44,3.72) v1(18.51,15.24) v1(18.57,14.43) v1(18.57,13.2) v1(18.57,12.43) v1(18.75,17.78) v1(18.79,5.95) v1(19.13,5.22) v1(19.13,4.49) v1(19.13,3.72) v1(19.44,17.78) v1(19.43,15.24) v1(19.49,14.43) v1(19.49,13.2) v1(19.49,12.43) v1(19.68,5.97) v1(19.82,5.22) v1(19.82,4.49) v1(19.82,3.72)
DIR: length 25.7
  Top Layer w0.254: R2.2 25.49,15.53 26.67,14.35 28.83,14.35 30.73,12.45 v1(30.86,12.45) ; v1(41.91,8.51) 41.91,8.25 42.29,7.87 43.03,7.87 H1.2 ; v1(33.4,9.65) 35.08,9.65 U2.5 36.08,10.55 v1(36.83,11.3) ; v1(40.77,9.65) 40.77,9.78 38.61,11.94 v1(38.48,11.94)
  Bottom Layer w0.254: v1(33.4,9.65) 33.4,9.91 v1(30.86,12.45) ; v1(38.48,11.94) 37.46,11.94 v1(36.83,11.3) ; v1(40.77,9.65) v1(41.91,8.51)
EN/IN2: length 8.2
  Top Layer w0.254: U2.6 35.11,8.76 33.31,8.76 31.02,11.06 30.4,11.06 U1.14
MVCC: length 1.1
  Top Layer w0.762: 35.23,24.12 CN1.1
PH/IN1: length 6.7
  Top Layer w0.254: U2.3 34.01,10.41 32.51,10.41 31.37,11.56 30.19,11.56 U1.15
PWM: length 21.8
  Top Layer w0.254: v1(39.88,9.02) 39.88,9.53 36.45,12.95 35.63,12.95 U2.2 34.1,11.43 33.53,11.43 32.39,12.57 32.39,13.08 29.93,15.53 R1.2 ; v1(41.02,7.75) 41.91,6.86 H1.1
  Bottom Layer w0.254: v1(41.02,7.75) 39.88,8.89 v1(39.88,9.02)
YH: length 14
  Top Layer w0.254: v1(24.77,9.65) 24.77,9.87 25.13,10.23 U1.24 ; v1(23.88,1.65) 23.86,1.64 20.06,1.64
  Bottom Layer w0.254: v1(23.88,1.65) 25.27,3.05 v1(25.27,3.82) 25.27,9.14 v1(24.77,9.65)
YL: length 18.9
  Top Layer w0.254: U5.4 10.03,7.61 11.05,8.64 19.3,8.64 19.81,9.14 21.97,9.14 24.26,11.43 25.97,11.43 U1.22
YVS: length 17.8
  Top Layer w0.254: 18.79,1.53 19.68,0.64 21.72,0.64 v1(21.84,0.76) ; 18.79,1.53 18.79,1.64 ; 18.79,1.53 17.62,1.53 17.52,1.64 ; U1.23 25.77,10.92 24.77,10.92 v1(23.37,9.53)
  Bottom Layer w0.254: v1(21.84,0.76) 22.61,1.52 22.61,8.76 v1(23.37,9.53)
  vias: v1(8.38,5.47) v1(8.38,4.78) v1(8.38,4.09) v1(8.38,3.41) v1(8.38,2.72) v1(8.38,2.03) v1(10.16,5.21) v1(10.16,3.05) v1(10.16,2.39) v1(10.21,4.45) v1(10.21,3.79) v1(10.85,5.21) v1(10.89,4.45) v1(10.89,3.79) v1(10.85,3.05) v1(10.85,2.39) v1(11.53,5.21) v1(11.58,4.45) v1(11.58,3.79) v1(11.53,3.05) v1(11.53,2.39) v1(12.22,5.21) v1(12.27,4.45) v1(12.27,3.79) v1(12.22,3.05) v1(12.22,2.39) v1(12.91,5.21) v1(12.95,4.45) v1(12.95,3.79) v1(12.91,3.05) v1(12.91,2.39) v1(13.59,5.21) v1(13.59,3.05) v1(13.59,2.39) v1(13.64,4.45) v1(13.64,3.79)
ZH: length 13.5
  Top Layer w0.254: U1.17 29.46,12.24 29.46,12.88 28.76,13.59 22.37,13.59 21.24,12.45 21.24,11.46 20.45,10.67 U4.4
ZL: length 25.4
  Top Layer w0.254: U6.4 9.98,16.94 9.52,17.4 8.31,17.4 7.87,16.96 v1(7.87,16.26) ; v1(23.75,12.32) 27.2,12.32 27.52,12
  Bottom Layer w0.254: v1(23.75,12.32) 22.23,13.84 15.49,13.84 14.22,15.11 9.02,15.11 v1(7.87,16.26)
ZVS: length 13.2
  Top Layer w0.254: U4.3 18.29,10.41 19.05,9.65 20.94,9.65 22.23,10.93 22.23,11.81 23.49,13.08 27.42,13.08 U1.18
  vias: v1(3.3,14.73) v1(3.43,13.97) v1(3.99,14.73) v1(4.12,13.97) v1(4.68,14.73) v1(4.8,13.97) v1(5.36,14.73) v1(5.49,13.97) v1(6.05,14.73) v1(6.18,13.97) v1(6.74,14.73) v1(6.86,13.97) v1(10.03,14.35) v1(10.05,13.64) v1(10.03,12.95) v1(10.03,12.22) v1(10.03,11.51) v1(10.72,14.35) v1(10.74,13.64) v1(10.72,12.95) v1(10.72,12.22) v1(10.72,11.51) v1(11.41,14.35) v1(11.42,13.64) v1(11.41,12.95) v1(11.41,12.22) v1(11.41,11.51) v1(12.09,14.35) v1(12.09,12.95) v1(12.09,12.22) v1(12.09,11.51) v1(12.11,13.64) v1(12.78,14.35) v1(12.8,13.64) v1(12.78,12.95) v1(12.78,12.22) v1(12.78,11.51) v1(13.47,14.35) v1(13.48,13.64) v1(13.47,12.95) v1(13.47,12.22) v1(13.47,11.51)
$1N2008: length 4.2
  Top Layer w0.254: 23.89,5.59 25.4,7.1 25.4,8.08 26.11,8.79 U1.2
$1N2043: length 3.9
  Top Layer w0.254: U1.4 26.54,7.91 26.54,7.51 27.94,6.11 27.94,5.36 27.67,5.09
$1N2047: length 2.9
  Top Layer w0.254: 26.68,6.08 26.68,6.59 26.04,7.24 26.04,8.11 U1.3
$1N4499: length 2.4
  Top Layer w0.254: LED1.2 R3.1

## Copper pours and planes (outline as drawn; the poured copper is in the pictures)
GND on Bottom Layer: -1.4,32.26 46.48,32.26 46.48,-1.91 -1.4,-1.91
VCC on Top Layer: 0.84,26.92 0.84,25.15 5.51,25.15 6.33,24.33 6.33,19.7 6.6,19.43 10.13,19.43 10.36,19.66 10.36,26.09 9.52,26.92
VCC on Top Layer: 15.62,8 15.62,2.81 22.88,2.81 23.11,3.05 23.11,8.29 23,8.4 20.03,8.4 19.71,8.08 15.7,8.08
VCC on Top Layer: 13.7,26.8 20.32,26.8 20.32,12.07 19.94,11.68 15.07,11.68 15.07,18.54 13.7,19.92
MVCC on Top Layer: 28.32,26.67 28.32,23.23 29.62,21.93 32.81,21.93 32.89,21.84 32.89,19.71 33.3,19.31 38.54,19.31 39.22,19.99 39.22,26.22 38.65,26.79 28.44,26.79
YVS on Top Layer: 0.9,6.28 0.9,0.49 0.93,0.46 19.36,0.46 19.36,2.34 19.43,2.41 15.37,2.41 15.11,2.67 15.11,5.72 14.73,6.1 9.14,6.1 8.89,6.35 0.96,6.35
ZVS on Top Layer: 1.49,7.49 7.75,7.49 7.87,7.62 7.87,7.75 9.27,9.14 18.29,9.14 18.82,9.67 18.82,11.47 14.73,11.47 14.73,14.73 14.22,15.24 1.52,15.24 1.49,15.21
$1N647 on Top Layer: 20.57,26.29 20.57,19.69 21.34,18.92 27.11,18.92 27.94,19.76 27.94,25.91 27.56,26.29

Small or netless copper shapes (teardrops, artwork), in the pictures only: 94 on Top Layer, 19 on Bottom Layer

## Text on the board
Top Layer: 常熟理工学院

# Board PCB2
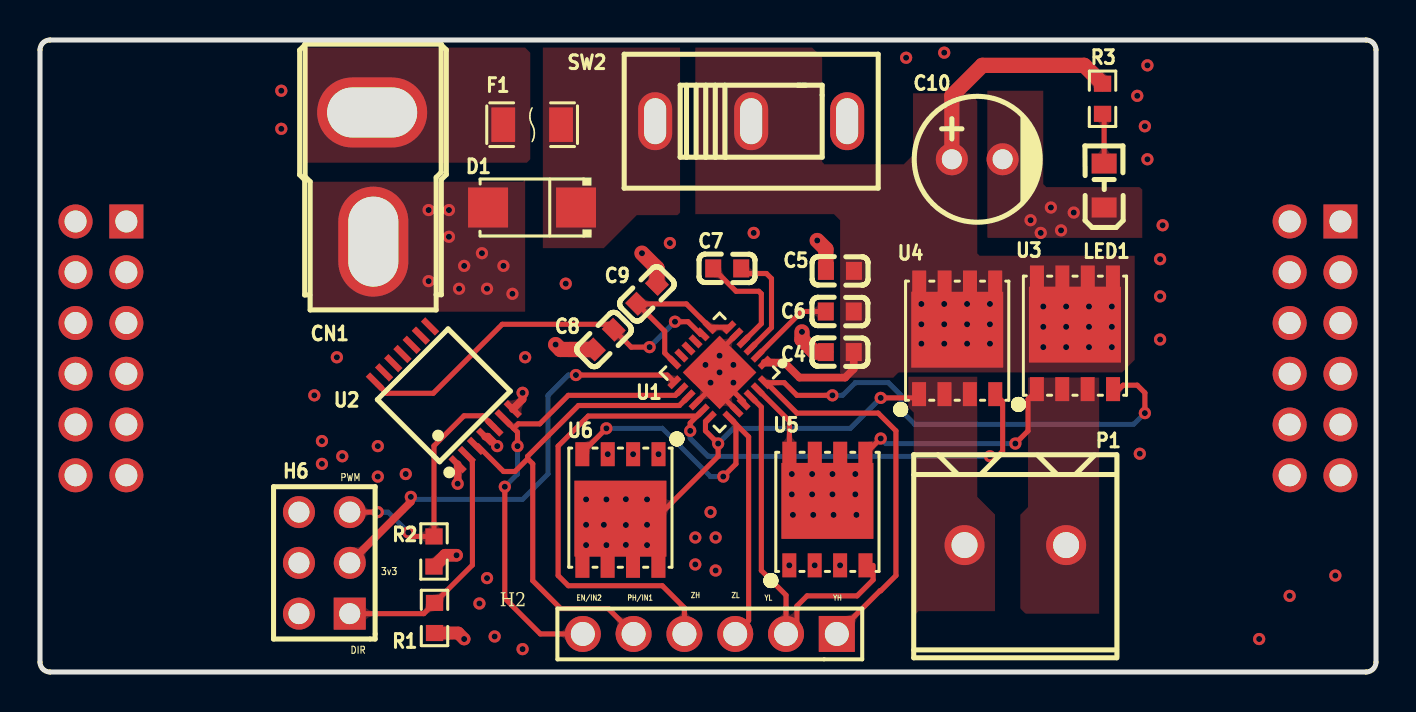
[diagram p4: board, top side]
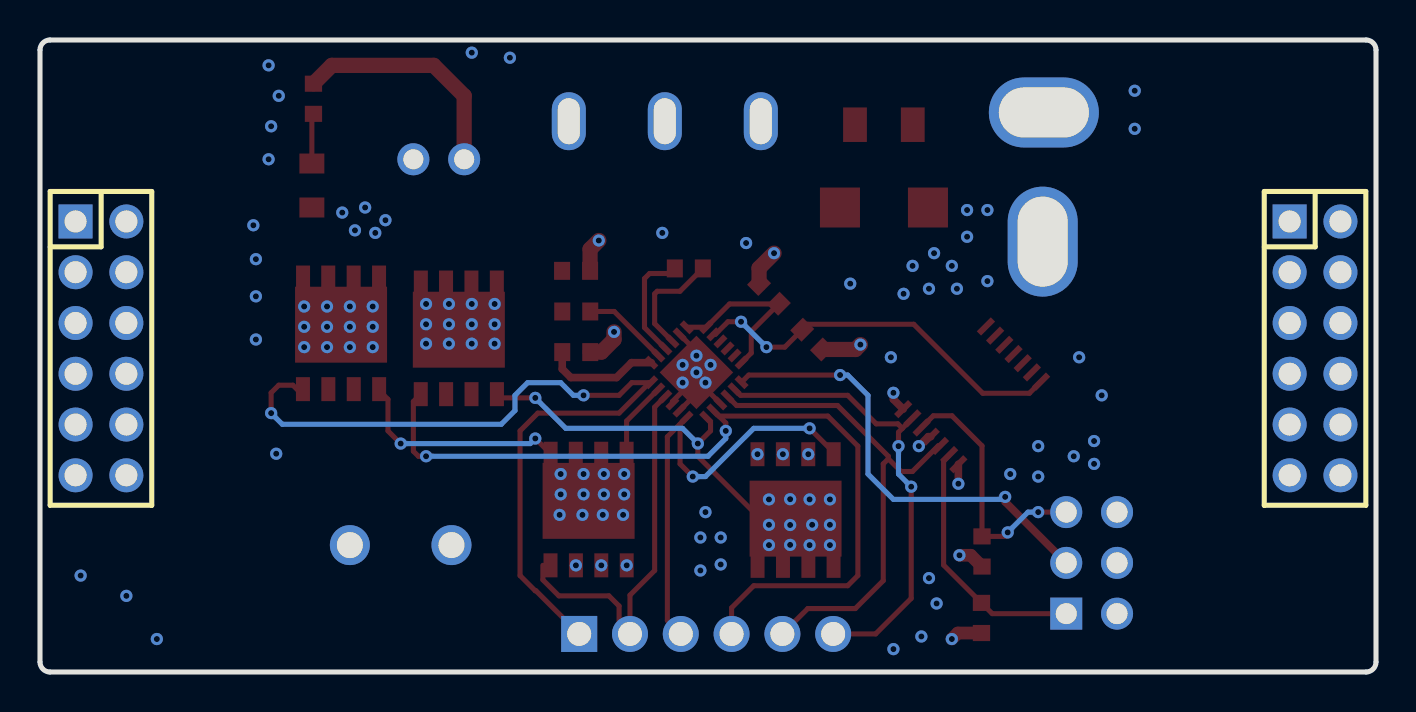
[diagram p5: board, bottom side, seen from below]

Outline 66.8 x 31.62 mm; copper layers: Top Layer, Bottom Layer. Coordinates in mm from the lower left corner of the outline.
Outline path: 0,31.12 0,0.5 arc(0.15,0.15) 0.5,0 66.3,0 arc(66.66,0.15) 66.8,0.5 66.8,31.12 arc(66.66,31.48) 66.3,31.62 0.5,31.62 arc(0.15,31.48) 0,31.12
Stack: Top Layer 0.035mm - / Dielectric1 1.51mm FR4 er 4.5 / Bottom Layer 0.035mm -

## Design rules (mm)
template: 自定义配置
spacing copperThickness1oz (default): track to track 0.102, other pairs 0.152 to 0.3
spacing copperThickness2oz: track to track 0.203, other pairs 0.152 to 0.3
track width copperThickness1oz (default): min 0.127, default 0.254, max 2.54
track width copperThickness2oz: min 0.203, default 0.254, max 2.54
differential pair differentialPair (default): width min 0.127, default 0.254, max 2.54; gap min 0.152, default 0.152
via viaSize (default): diameter min 0.5, default 0.61, max 10; hole min 0.3, default 0.305, max 6.3

## Placement (name value [footprint] x y rotation side)
C4  100nF  [C0603]  39.99 16.01 180 top
C5  10uF  [C0603]  40 20.07 180 top
C6  1uF  [C0603]  39.99 18.04 180 top
C7  100nF  [C0603]  34.36 20.19 0 top
C8  1uF  [C0603]  28.19 16.63 225 top
C9  1uF  [C0603]  30.35 18.92 45 top
C10  100uF  [CAP-TH_BD6.3-P2.50-D1.0-FD]  46.86 25.65 0 top
CN1  AM-1015B-M  [CONN-TH_AM-1015B-M]  16.64 24.77 270 top
D1  SS24  [SMA_L4.3-W2.6-LS5.2-RD]  24.6 23.24 180 top
F1  JK-NSMD200  [F1206]  24.61 27.38 0 top
H2  -  [HDR-TH_6P-P2.54-V-M-1]  33.49 1.91 180 top
H6  -  [HDR-TH_6P-P2.54-V-R2-C3-S2.54_A2541WV-2X3P]  14.22 5.46 90 top
H7  -  [HDR-TH_12P-P2.54-V-M-R2-C6-S2.54]  3.05 16.19 270 bottom
H8  -  [HDR-TH_12P-P2.54-V-M-R2-C6-S2.54]  63.75 16.19 270 bottom
LED1  -  [LED_0805]  53.21 24.39 90 top
P1  WJ500V-5.08-2P  [CONN-TH_2P-P5.00_WJ500V-5.08-2P]  48.77 6.35 180 top
R1  10kΩ  [R0603]  19.73 2.7 90 top
R2  10kΩ  [R0603]  19.7 6.03 90 top
R3  10kΩ  [R0603]  53.13 28.68 90 top
SW2  SS12D10G4 071  [SW-TH_SHOU-HAN_SS12D10G4]  35.56 27.56 0 top
U1  DRV8701ERGER  [VQFN-24_L4.0-W4.0-P0.50-BL-EP2.5]  33.98 14.99 135 top
U2  SN74HC125PWR  [TSSOP-14_L5.0-W4.4-P0.65-LS6.5-BL]  20.19 13.84 45 top
U3  NP60S04D6  [PDFN-8_L5.8-W4.9-P1.27-LS6.1-BL]  51.75 16.95 0 top
U4  NP60S04D6  [PDFN-8_L5.8-W4.9-P1.27-LS6.1-BL]  45.86 16.7 0 top
U5  NP60S04D6  [PDFN-8_L5.8-W4.9-P1.27-LS6.1-BL]  39.37 8.13 0 top
U6  NP60S04D6  [PDFN-8_L5.8-W4.9-P1.27-LS6.1-BL]  29.02 8.11 180 top

## Footprints (pads in the part's own frame, mm; a bottom-side part is the same pattern mirrored in y, then rotated)
C0603
  rect 0.8x0.9 smd: 1(-0.7,0) 2(0.7,0)
CAP-TH_BD6.3-P2.50-D1.0-FD
  round 1.6 hole 1: 1(-1.27,0) 2(1.27,0)
CONN-TH_2P-P5.00_WJ500V-5.08-2P
  round 2 hole 1.3: 1(-2.54,0) 2(2.54,0)
CONN-TH_AM-1015B-M
  oval 3.5x5.5 hole 2.5x4.5: 1(-3.231,-0.029)
  oval 5.5x3.5 hole 4.5x2.5: 2(3.231,0.029)
F1206
  rect 1.19x1.728 smd: 1(-1.445,0) 2(1.445,0)
HDR-TH_6P-P2.54-V-M-1
  rect 1.8x1.8 hole 1.2: 1(-6.35,0)
  round 1.8 hole 1.2: 2(-3.81,0) 3(-1.27,0) 4(1.27,0) 5(3.81,0) 6(6.35,0)
HDR-TH_6P-P2.54-V-R2-C3-S2.54_A2541WV-2X3P
  rect 1.6x1.6 hole 1.05: 1(-2.54,-1.27)
  round 1.6 hole 1.05: 2(-2.54,1.27) 3(0,-1.27) 4(0,1.27) 5(2.54,-1.27) 6(2.54,1.27)
HDR-TH_12P-P2.54-V-M-R2-C6-S2.54
  rect 1.7x1.7 hole 1.1: 1(-6.35,-1.27)
  round 1.7 hole 1.1: 2(-6.35,1.27) 3(-3.81,-1.27) 4(-3.81,1.27) 5(-1.27,-1.27) 6(-1.27,1.27) 7(1.27,-1.27) 8(1.27,1.27) 9(3.81,-1.27) 10(3.81,1.27) 11(6.35,-1.27) 12(6.35,1.27)
LED_0805
  rect 1x1.25 smd: 1(-1.15,0.005) 2(1.05,0.005)
PDFN-8_L5.8-W4.9-P1.27-LS6.1-BL
  rect 0.7x1.2 smd: 1(-1.905,-2.792) 2(-0.635,-2.792) 3(0.635,-2.792) 4(1.905,-2.792) 5(1.9,2.792) 6(0.64,2.792) 7(-0.63,2.792) 8(-1.9,2.792)
  rect 4.6x3.8 smd: 9(0,0.432)
R0603
  rect 0.806x0.864 smd: 1(-0.753,0) 2(0.753,0)
SMA_L4.3-W2.6-LS5.2-RD
  rect 2x2 smd: 1(-2.2,0) 2(2.2,0)
SW-TH_SHOU-HAN_SS12D10G4
  oval 1.7x2.9 hole 1.1x2.3: 1(-4.8,0) 2(0,0) 3(4.8,0)
TSSOP-14_L5.0-W4.4-P0.65-LS6.5-BL
  rect 0.305x0.991 smd: 1(-1.95,-2.925) 2(-1.3,-2.925) 3(-0.65,-2.925) 4(0,-2.925) 5(0.65,-2.925) 6(1.3,-2.925) 7(1.95,-2.925) 8(1.95,2.925) 9(1.3,2.925) 10(0.65,2.925) 11(0,2.925) 12(-0.65,2.925) 13(-1.3,2.925) 14(-1.95,2.925)
VQFN-24_L4.0-W4.0-P0.50-BL-EP2.5
  rect 0.3x0.7 smd: 1(-1.25,-1.942) 2(-0.75,-1.942) 3(-0.25,-1.942) 4(0.25,-1.942) 5(0.75,-1.942) 6(1.25,-1.942) 13(1.25,1.942) 14(0.75,1.942) 15(0.25,1.942) 16(-0.25,1.942) 17(-0.75,1.942) 18(-1.25,1.942)
  rect 0.7x0.3 smd: 7(1.948,-1.25) 8(1.948,-0.75) 9(1.948,-0.25) 10(1.948,0.25) 11(1.948,0.75) 12(1.948,1.25) 19(-1.948,1.25) 20(-1.948,0.75) 21(-1.948,0.25) 22(-1.948,-0.25) 23(-1.948,-0.75) 24(-1.948,-1.25)
  rect 2.6x2.6 smd: 25(0.001,-0.001)

## Nets
As in the schematic.

Pads without a net: H6 2 6; H7 1 2 3 4 5 6 7 8 9 10 11 12; H8 1 2 3 4 5 6 7 8 9 10 11 12; SW2 3; U1 9 10 11; U2 8 9 10 11 12 13

## Via types
v1: diameter 0.61, hole 0.305, Top Layer to Bottom Layer, 140 vias

## Routing (per net, layer and track width the routed paths; a pad name or vN(x,y) marks a point on that pad's centre or on a via; arc(x,y) is an arc through that point)
+3.3V: length 22.8
  Top Layer w0.254: v1(26.8,14.86) 31.36,14.86 31.72,14.5
  Top Layer w0.381: H6.3 18.54,8.52 v1(18.54,8.76)
  Bottom Layer w0.254: v1(18.54,8.76) 18.67,8.64 24.13,8.64 25.4,9.91 25.4,13.84 26.42,14.86 v1(26.8,14.86)
AVDD: length 8.8
  Top Layer w0.254: U1.12 31.24,15.96 31.24,17.05 29.87,18.42 ; 29.87,18.42 C9.1 ; 29.87,18.42 32.32,18.42 U1.7 34.46,17.25 34.47,17.25
DVDD: length 19.3
  Top Layer w0.254: U2.14 17.33,13.95 19.66,13.95 23.11,17.4 28.42,17.4 C8.1 29.56,16.26 v1(30.48,16.26) ; U1.8 33.03,16.9 32.4,17.53 v1(31.75,17.53)
  Bottom Layer w0.254: v1(31.75,17.53) v1(30.48,16.26)
GND: length 21.5
  Top Layer w0.254: 33.98,14.74 v1(33.98,14.99) 33.98,16.05 U1.5 ; 33.98,14.74 35.18,13.53 U1.21 ; 33.98,14.74 33.98,14.64 ; U1.20 33.98,13.93 33.98,14.64 ; U1.16 33.98,14.64 ; C8.2 27.45,16.38
  Top Layer w0.381: U2.4 22.39,11.77 v1(22.86,11.3) ; 20.88,10.4 v1(20.88,9.42) ; v1(24.13,13.97) 24.13,13.64 U2.7
  Top Layer w0.635: v1(20.83,5.84) 20.26,5.84 R2.1 ; R1.1 20.91,1.95 v1(21.21,1.65)
  Top Layer w0.762: C9.2 30.85,20.21 v1(30.1,20.95) ; v1(38.1,17.02) 38.1,16.64 38.73,16.01 C4.2 ; v1(25.78,16.38) 26.03,16.14 C8.2 ; 39.3,20.07 39.3,21.16 v1(38.86,21.59)
  vias: v1(12.07,29.08) v1(12.07,27.18) v1(12.95,5.46) v1(14.1,10.41) v1(15.11,10.8) v1(19.43,23.11) v1(19.43,19.56) v1(20.45,23.11) v1(20.45,21.78) v1(20.95,19.18) v1(21.21,20.32) v1(22.1,20.95) v1(22.35,19.18) v1(23.17,20.32) v1(23.62,18.92) v1(28.39,10.9) v1(29.66,10.9) v1(30.93,10.9) v1(33.27,15.37) v1(33.53,14.48) v1(33.78,6.73) v1(33.98,15.83) v1(34.67,15.37) v1(34.67,14.48) v1(37.47,5.34) v1(38.74,5.34) v1(40.01,5.34) v1(49.53,22.61) v1(50.04,21.97) v1(50.55,23.24) v1(51.05,22.1) v1(51.69,22.99) v1(54.86,28.83) v1(54.99,10.92) v1(55.24,27.31) v1(55.37,30.35) v1(55.37,25.65) v1(56.01,20.66) v1(56.01,18.8) v1(56.01,16.64) v1(56.13,22.35)
VCC: length 17.5
  Top Layer w0.381: U1.1 37.23,15.48 37.97,14.73 40.26,14.73 40.69,15.16 C4.1
  Top Layer w0.762: C10.1 45.59,28.83 47.12,30.35 52.21,30.35 R3.2
  vias: v1(44.07,18.42) v1(44.07,17.4) v1(44.07,16.43) v1(45.21,18.42) v1(45.21,17.4) v1(45.21,16.43) v1(46.36,18.42) v1(46.36,17.4) v1(46.36,16.43) v1(47.5,18.42) v1(47.5,17.4) v1(47.5,16.43) v1(50.17,18.29) v1(50.17,17.27) v1(50.17,16.26) v1(51.31,18.29) v1(51.31,17.27) v1(51.31,16.26) v1(52.45,18.29) v1(52.45,17.27) v1(52.45,16.26) v1(53.59,18.29) v1(53.59,17.27) v1(53.59,16.26)
(no net):
  vias: v1(13.72,13.84) v1(14.1,11.56) v1(14.84,15.75) v1(16.89,11.3) v1(16.89,9.78) v1(18.29,9.91) v1(21.97,3.43) v1(22.35,4.7) v1(22.73,1.78) v1(24.13,1.15) v1(24.26,15.75) v1(26.29,19.43) v1(31.5,21.46) v1(32.77,6.73) v1(32.77,5.38) v1(33.53,8) v1(33.78,5.08) v1(35.69,21.97) v1(43.31,30.73) v1(45.21,30.99) v1(60.96,1.65) v1(62.48,3.81) v1(64.77,4.83)
DIR: length 13.2
  Top Layer w0.254: v1(18.42,6.98) 18.49,6.91 18.49,6.78 R2.2 19.7,11.32 21.2,12.82 22.14,12.82 U2.5 ; H6.5 v1(16.89,8)
  Bottom Layer w0.254: v1(16.89,8) 17.4,8 v1(18.42,6.98)
EN/IN2: length 23.4
  Top Layer w0.254: H2.6 25.02,1.91 23.24,3.68 v1(23.24,9.27) ; U1.14 31.77,13.84 26.42,13.84 24.99,12.42 23.91,12.42 23.68,12.19 ; v1(23.88,11.3) 23.88,12 23.68,12.19 ; 23.68,12.19 U2.6
  Bottom Layer w0.254: v1(23.24,9.27) 23.88,9.91 v1(23.88,11.3)
PH/IN1: length 25.1
  Top Layer w0.254: 24.38,10.67 24.64,10.41 24.64,4.57 26.04,3.17 28.41,3.17 H2.5 ; 24.38,10.67 23.75,10.03 23.18,10.03 21.89,11.31 U2.3 ; 24.38,10.67 24.38,10.8 26.92,13.33 31.97,13.33 U1.15
PWM: length 12.8
  Top Layer w0.254: H6.1 19.19,2.92 R1.2 21.62,5.35 21.62,10.58 U2.2
YH: length 42.9
  Top Layer w0.254: 36.32,14.48 37.21,14.48 37.85,13.84 v1(39.62,13.84) ; 36.32,14.48 36.26,14.48 U1.24 ; 36.32,14.48 37.85,12.95 41.91,12.95 42.8,12.06 42.8,4.83 42.04,4.06 42,4.06 H2.1 ; 53.71,13.9 54.16,14.35 54.86,14.35 55.24,13.97 v1(55.24,12.95)
  Bottom Layer w0.254: v1(39.62,13.84) 40.13,13.84 40.77,14.48 42.42,14.48 43.05,13.84 43.05,13.08 43.74,12.4 54.69,12.4 v1(55.24,12.95)
YL: length 19.3
  Top Layer w0.254: 41.66,5.34 41.66,4.61 40.86,3.81 38.35,3.81 37.85,3.3 37.85,2.45 H2.2 37.3,3.85 36.07,5.08 36.07,13.25 U1.22
YVS: length 14.9
  Top Layer w0.254: U1.23 37.47,12.56 U5.8 ; 49.9,13.9 49.66,13.9 49.4,13.64 49.4,12.06 v1(48.77,11.43) ; v1(42.04,11.68) 42.03,11.68 U5.5
  Bottom Layer w0.254: v1(48.77,11.43) 42.29,11.43 v1(42.04,11.68)
  vias: v1(37.59,9.91) v1(37.59,8.89) v1(37.65,7.86) v1(38.61,9.91) v1(38.61,8.89) v1(38.66,7.86) v1(39.62,9.91) v1(39.62,8.89) v1(39.68,7.86) v1(40.77,9.91) v1(40.77,8.89) v1(40.82,7.86)
ZH: length 43.1
  Top Layer w0.254: 32.86,12.81 32.51,12.46 v1(32.51,12.06) ; 32.86,12.81 U1.17 ; 32.86,12.81 27.41,12.81 25.91,11.3 25.91,4.83 26.42,4.32 31.11,4.32 32.22,3.21 H2.4 ; U4.4 48.13,13.53 48.13,11.05 47.88,10.8 v1(47.5,10.8)
  Bottom Layer w0.254: v1(47.5,10.8) 33.4,10.8 32.51,11.68 v1(32.51,12.06)
ZL: length 23
  Top Layer w0.254: v1(28.32,12.19) 27.12,10.99 U6.4 ; 34.8,12.4 34.8,10.41 v1(34.16,9.78) ; 34.8,12.4 35.43,11.77 35.43,2.58 H2.3 ; 34.8,12.4 34.47,12.73
  Bottom Layer w0.254: v1(28.32,12.19) 31.11,12.19 33.53,9.78 v1(34.16,9.78)
ZVS: length 19.5
  Top Layer w0.254: U6.9 30.79,7.67 33.91,10.8 v1(33.91,11.43) 33.27,12.06 33.27,12.52 33.49,12.73 ; U4.1 43.77,13.72 v1(42.04,13.72)
  Bottom Layer w0.254: v1(33.91,11.43) 34.67,12.19 40.51,12.19 v1(42.04,13.72)
  vias: v1(27.3,8.64) v1(27.3,7.37) v1(27.3,6.35) v1(28.19,7.37) v1(28.32,8.64) v1(28.32,6.35) v1(29.29,8.65) v1(29.29,7.36) v1(29.29,6.36) v1(30.35,8.64) v1(30.35,7.37) v1(30.35,6.35)
$1N1370: length 4.3
  Top Layer w0.254: 35.88,15.83 38.09,18.04 C6.2
$1N1371: length 5.7
  Top Layer w0.254: C7.1 34.8,19.05 35.94,19.05 36.07,18.92 36.07,17.43 U1.4
$1N1372: length 5.7
  Top Layer w0.254: U1.3 36.58,17.23 36.58,19.69 36.32,19.94 35.31,19.94 C7.2
$1N1403: length 2.5
  Top Layer w0.254: LED1.2 53.21,27.85 53.13,27.93

## Copper pours and planes (outline as drawn; the poured copper is in the pictures)
GND on Top Layer: 13.46,24.64 24.26,24.64 24.26,18.03 13.46,18.03
GND on Top Layer: 47.37,29.08 55.12,29.08 55.12,21.72 47.37,21.72
GND on Top Layer: 10.16,36.58 58.29,36.58 58.29,-2.79 10.16,-2.79
GND on Bottom Layer: 11.18,34.42 56.77,34.42 56.77,-1.65 11.18,-1.65
VCC on Top Layer: 32.77,31.24 54.74,31.24 54.74,14.73 32.77,14.73
MVCC on Top Layer: 13.11,31.25 24.51,31.25 24.51,25.48 13.11,25.48
YVS on Top Layer: 49.02,14.73 52.96,14.73 52.96,2.92 49.02,2.92
ZVS on Top Layer: 43.41,14.77 47.75,14.77 47.75,2.8 43.41,2.8
$1N1344 on Top Layer: 25.15,31.24 32,31.24 32,21.21 25.15,21.21

Small or netless copper shapes (teardrops, artwork), in the pictures only: 101 on Top Layer, 18 on Bottom Layer

## Text on the board
Top Silkscreen Layer: EN/IN2 | PH/IN1 | ZH | ZL | YL | YH | PWM | DIR | 3v3
